# EAGLE design RocketometerPx 9150 (EAGLE 6.2)
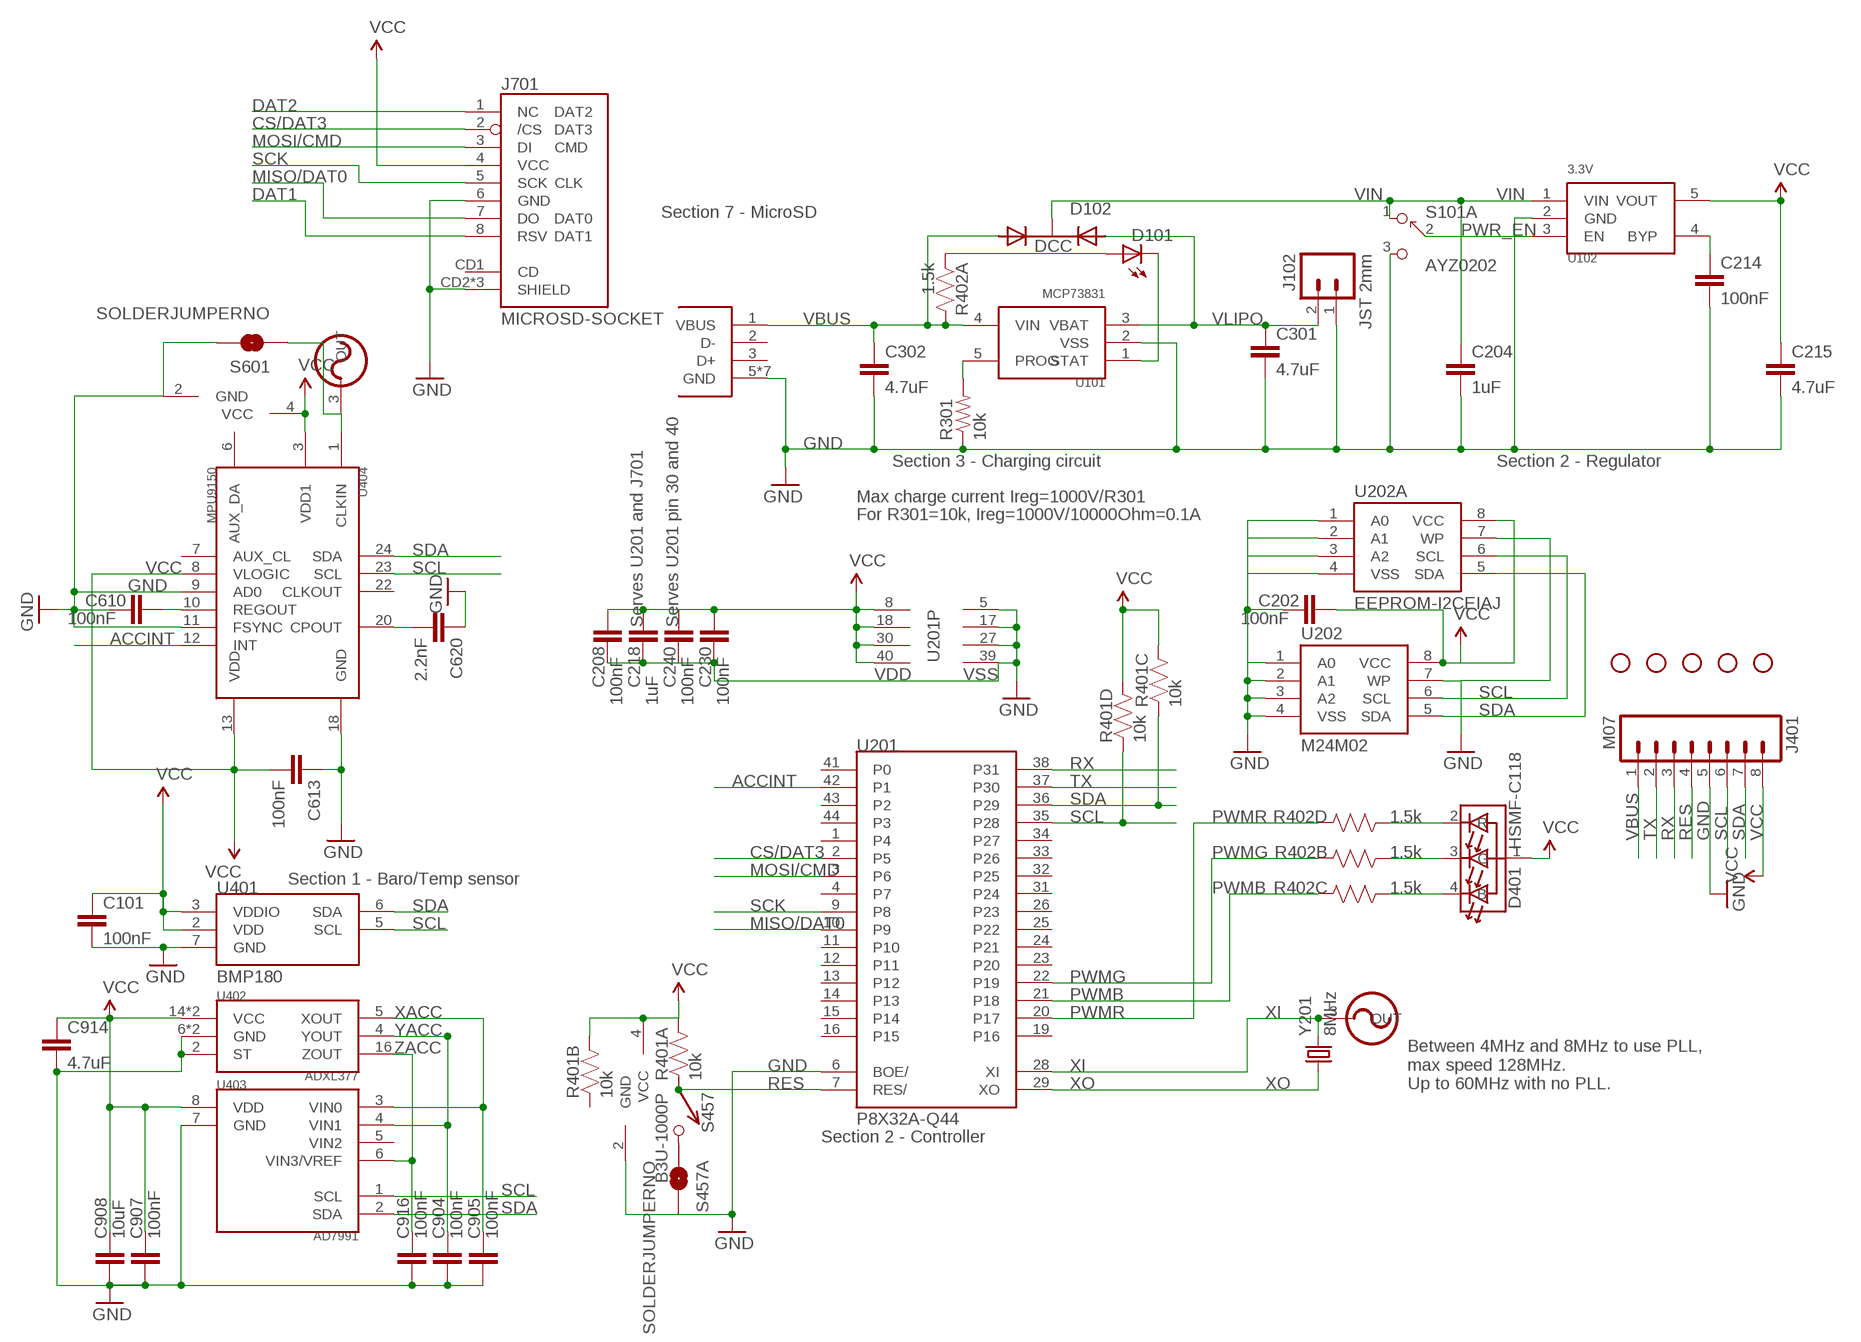
[diagram p0: schematic, sheet 1]

## Parts
C101  100nF  CAP0402-CAP  [0402-CAP]
C202  100nF  CAP0402-CAP  [0402-CAP]
C204  1uF  CAP0402-CAP  [0402-CAP]
C208  100nF  CAP0402-CAP  [0402-CAP]
C214  100nF  CAP0402-CAP  [0402-CAP]
C215  4.7uF  CAP0402-CAP  [0402-CAP]
C218  1uF  CAP0402-CAP  [0402-CAP]
C230  100nF  CAP0402-CAP  [0402-CAP]
C240  100nF  CAP0402-CAP  [0402-CAP]
C301  4.7uF  CAP0402-CAP  [0402-CAP]
C302  4.7uF  CAP0402-CAP  [0402-CAP]
C610  100nF  CAP0402-CAP  [0402-CAP]
C613  100nF  CAP0402-CAP  [0402-CAP]
C620  2.2nF  CAP0402-CAP  [0402-CAP]
C904  100nF  CAP0402-CAP  [0402-CAP]
C905  100nF  CAP0402-CAP  [0402-CAP]
C907  100nF  CAP0402-CAP  [0402-CAP]
C908  10uF  CAP0603-CAP  [0603-CAP]
C914  4.7uF  CAP0402-CAP  [0402-CAP]
C916  100nF  CAP0402-CAP  [0402-CAP]
D101  YELLOW  LED0603  [LED-0603]
D102  DCC  PMEG2005CT  [SOT-23-3]
D401  HSMF-C118  [HSMF-C118]
J101  USB_MICROB_JSTGCT  [USB_MICROB_3075]
J102  JST 2mm  M02-JST-2MM-SMT  [JST-2-SMD]
J401  M07  M081X08  [1X08]
J701  MICROSD-SOCKET  [MICROSD-SOCKET-PP]
JP1  STAND-OFFTIGHT  [STAND-OFF-TIGHT]
JP2  STAND-OFFTIGHT  [STAND-OFF-TIGHT]
JP3  STAND-OFFTIGHT  [STAND-OFF-TIGHT]
JP4  STAND-OFFTIGHT  [STAND-OFF-TIGHT]
JP5  STAND-OFFTIGHT  [STAND-OFF-TIGHT]
R301  10k  RESISTOR0402-RES  [0402-RES]
R401  10k  RP404  [CRA04]
R402  1.5k  RP404  [CRA04]
S101  AYZ0202  [AYZ0202]
S457  B3U-1000P  [B3U-1000P]
S457A  SOLDERJUMPERNO  [SJ_2S-NO]
S601  SOLDERJUMPERNO  [SJ_2S-NO]
U101  MCP73831  [SOT-23-5]
U102  3.3V  MIC5319D5  [SOT-23-5]
U201  P8X32A-Q44  [P8X32A-Q44]
U202  M24M02  EEPROM-I2C  [SO8N]
U202A  EEPROM-I2CEIAJ  [SO08-EIAJ]
U401  BMP180  [BMP180]
U402  ADXL377  [ADXL377]
U403  AD7991  AD799X  [SOT-23-8]
U404  MPU9150  MPU6050  [MPU60X0]
Y201  8MHz  NX3225GD  [CRYSTAL_SMD_3_2MM_2_5MM]
Y202  8MHz  EM53T  [CRYSTAL_SMD_5MM_3_2MM]
Y401  19.2MHz  EM53T  [CRYSTAL_SMD_5MM_3_2MM]

## Nets
ACCINT: U201.42(P1) U404.12(INT)
CS/DAT3: J701.2(/CS) U201.2(P5)
DAT1: J701.8(RSV)
DAT2: J701.1(NC)
GND [power]: C101.2 C202.2 C204.2 C208.2 C214.2 C215.2 C218.2 C230.2 C240.2 C301.2 C302.2 C610.2 C613.1 C620.1 C904.2 C905.2 C907.2 C908.2 C914.2 C916.2 J101.5(GND) J101.P$1(GND) J101.P$2(GND) J101.P$3(GND) J101.P$4(GND) J101.P$8(GND) J101.P$10(GND) J102.1 J401.5 J701.6(GND) J701.CD2(SHIELD) J701.GND1(SHIELD) J701.GND3(SHIELD) R301.1 S101.3 S457A.2 S601.2 U101.2(VSS) U102.2(GND) U201.5(VSS) U201.6(BOE/) U201.17(VSS) U201.27(VSS) U201.39(VSS) U202.1(A0) U202.2(A1) U202.3(A2) U202.4(VSS) U202.7(WP) U202A.1(A0) U202A.2(A1) U202A.3(A2) U202A.4(VSS) U202A.7(WP) U401.7(GND) U402.2(ST) U402.6(GND) U402.7(GND) U403.7(GND) U404.9(AD0) U404.11(FSYNC) U404.18(GND) Y202.2(GND) Y401.2(GND)
MISO/DAT0: J701.7(DO) U201.10(P9)
MOSI/CMD: J701.3(DI) U201.3(P6)
N$1: C620.2 U404.20(CPOUT)
N$2: R301.2 U101.5(PROG)
N$3: S601.1 U404.1(CLKIN) Y401.3(OUT)
N$4: D101.C U101.1(STAT)
N$5: D101.A R402.1
N$8: S457.P$2 S457A.1
N$13: C610.1 U404.10(REGOUT)
N$17: C214.1 U102.4(BYP)
PWMB: R402.6 U201.21(P18)
PWMG: R402.7 U201.22(P19)
PWMR: R402.5 U201.20(P17)
PWR_EN: S101.2 U102.3(EN)
QWMB: D401.4(B) R402.3
QWMG: D401.3(G) R402.2
QWMR: D401.2(R) R402.4
RES: J401.4 R401.1 S457.P$1 U201.7(RES/)
RX: J401.3 U201.38(P31)
SCK: J701.5(SCK) U201.9(P8)
SCL: J401.6 R401.4 U201.35(P28) U202.6(SCL) U202A.6(SCL) U401.5(SCL) U403.1(SCL) U404.23(SCL)
SDA: J401.7 R401.3 U201.36(P29) U202.5(SDA) U202A.5(SDA) U401.6(SDA) U403.2(SDA) U404.24(SDA)
TX: J401.2 U201.37(P30)
VBUS: C302.1 D102.1(A1) J101.1(VBUS) J401.1 R402.8 U101.4(VIN)
VCC [power]: C101.1 C202.1 C208.1 C215.1 C218.1 C230.1 C240.1 C613.2 C907.1 C908.1 C914.1 D401.1(A) J401.8 J701.4(VCC) R401.5 R401.6 R401.7 R401.8 U102.5(VOUT) U201.8(VDD) U201.18(VDD) U201.30(VDD) U201.40(VDD) U202.8(VCC) U202A.8(VCC) U401.2(VDD) U401.3(VDDIO) U402.14(VCC) U402.15(VCC) U403.8(VDD) U404.3(VDD1) U404.8(VLOGIC) U404.13(VDD) Y202.4(VCC) Y401.4(VCC)
VIN: C204.1 D102.3(K) S101.1 U102.1(VIN)
VLIPO: C301.1 D102.2(A2) J102.2 U101.3(VBAT)
XACC: C905.1 U402.5(XOUT) U403.3(VIN0)
XI: U201.28(XI) Y201.2 Y202.3(OUT)
XO: U201.29(XO) Y201.1
YACC: C904.1 U402.4(YOUT) U403.4(VIN1)
ZACC: C916.1 U402.16(ZOUT) U403.6(VIN3/VREF)
Unconnected: J101.2(D-) J101.3(D+) J701.CD1(CD) R401.2 S101.4 S101.5 S101.6 U201.1(P4) U201.4(P7) U201.11(P10) U201.12(P11) U201.13(P12) U201.14(P13) U201.15(P14) U201.16(P15) U201.19(P16) U201.23(P20) U201.24(P21) U201.25(P22) U201.26(P23) U201.31(P24) U201.32(P25) U201.33(P26) U201.34(P27) U201.41(P0) U201.43(P2) U201.44(P3) U403.5(VIN2) U404.6(AUX_DA) U404.7(AUX_CL) U404.22(CLKOUT)

## Notes on the sheet
- Section 7 - MicroSD
- Section 3 - Charging circuit | Section 2 - Regulator
- Max charge current Ireg=1000V/R301
- For R301=10k, Ireg=1000V/10000Ohm=0.1A
- Serves U201 and J701 | Serves U201 pin 30 and 40
- Section 1 - Baro/Temp sensor
- Between 4MHz and 8MHz to use PLL,
  max speed 128MHz. 
  Up to 60MHz with no PLL.
- Section 2 - Controller

## Library data of the parts
C101 C202 C208 C214 C230 C240 C610 C613 C904 C905 C916 = SparkFun:CAP: Capacitor Standard 0603 ceramic capacitor, and 0.1" leaded capacitor.; DIGIKEY: 445-1265-1-ND; NEWARK: 90R7596
C204 C218 = SparkFun:CAP: Capacitor Standard 0603 ceramic capacitor, and 0.1" leaded capacitor.; DIGIKEY: 445-4114-1-ND; NEWARK: 90R7580
C215 C301 C302 C914 = SparkFun:CAP: Capacitor Standard 0603 ceramic capacitor, and 0.1" leaded capacitor.; DIGIKEY: 445-7395-1-ND; NEWARK: 48T2906
C620 = SparkFun:CAP: Capacitor Standard 0603 ceramic capacitor, and 0.1" leaded capacitor.; DIGIKEY: 445-1257-1-ND; NEWARK: 90R7610
C907 = SparkFun-Passives:CAP: Capacitor Standard 0603 ceramic capacitor, and 0.1" leaded capacitor.; DIGIKEY: 445-1265-1-ND; NEWARK: 90R7596
C908 = SparkFun:CAP: Capacitor Standard 0603 ceramic capacitor, and 0.1" leaded capacitor.; DIGIKEY: 445-7486-1-ND; NEWARK: 48T2910
D101 = SparkFun:LED: LEDs Standard schematic elements and footprints for 5mm, 3mm, 1206, and 0603 sized LEDs. 5mm - Spark Fun Electronics SKU : COM-00529 (and others); DIGIKEY: 350-2032-1-ND; NEWARK: 38K3376
D102 = KwanSystems:PMEG2005CT; DIGIKEY: 568-6500-1-ND
D401 = KwanSystems:HSMF-C118; DIGIKEY: 516-1778-1-ND; NEWARK: 52M8002
J101 = KwanSystems:USB_MICROB_JST; DIGIKEY: 455-2562-1-ND
J102 = SparkFun:M02: Header 2 Standard 2-pin 0.1" header. Use with straight break away headers (SKU : PRT-00116), right angle break away headers (PRT-00553), swiss pins (PRT-00743), machine pins (PRT-00117), and female headers (PRT-00115). Molex polarized connector foot print use with SKU : PRT-08233 with associated crimp pins and housings.; DIGIKEY: 455-1749-1-ND
J401 = SparkFun-Connectors:M08: Header 8 Standard 8-pin 0.1" header. Use with straight break away headers (SKU : PRT-00116), right angle break away headers (PRT-00553), swiss pins (PRT-00743), machine pins (PRT-00117), and female headers (PRT-00115).; DIGIKEY: $NOPART
J701 = KwanSystems:MICROSD-SOCKET: microSD Socket Push-push type uSD socket. Digikey 101-00660-68-6-1-ND. tDoc lines correctly indicate media card edge positions when inserting (unlocked, locked, depressed).; DIGIKEY: 101-00581-59-1-ND
JP1 JP2 = SparkFun-Electromechanical:STAND-OFF: #4 Stand Off This is the mechanical footprint for a #4 phillips button head screw. Use the keepout ring to avoid running the screw head into surrounding components. SKU : PRT-00447; DIGIKEY: $NOPART
JP3-JP5 = SparkFun-Electromechanical:STAND-OFF: #4 Stand Off This is the mechanical footprint for a #4 phillips button head screw. Use the keepout ring to avoid running the screw head into surrounding components. SKU : PRT-00447; DIGIKEY: $NOPART; NEWARK: $NOPART
R301 = SparkFun:RESISTOR: Resistor Basic schematic elements and footprints for 0603, 1206, and PTH resistors.; DIGIKEY: P10.0KLCT-ND
R401 = KwanSystems:RP4; DIGIKEY: CRA4S810KCT-ND
R402 = KwanSystems:RP4; DIGIKEY: CRA4S81.5KCT-ND
S101 = KwanSystems:AYZ0202; DIGIKEY: 401-2013-1-ND
S457 = KwanSystems:B3U-1000P; DIGIKEY: SW1020CT-ND
S457A S601 = SparkFun-Passives:SOLDERJUMPER: Solder Jumper Standard SMD solder jumper. Used to automate production. Two varients : Normally Open and Normally Closed are the same, but have different paste layers. NC will have a large amount of paste and should jumper during reflow.; DIGIKEY: $NOPART; NEWARK: $NOPART
U101 = KwanSystems:MCP73831; DIGIKEY: 576-1910-1-ND
U102 = KwanSystems:MIC5319; DIGIKEY: 576-1910-1-ND
U201 = KwanSystems:P8X32A-Q44: Propellor uC; DIGIKEY: P8X32A-Q44-ND
U202 = KwanSystems:EEPROM-I2C; DIGIKEY: 497-11600-1-ND
U202A = KwanSystems:EEPROM-I2C; DIGIKEY: $NOPART
U401 = KwanSystems:BMP180; DIGIKEY: 828-1027-1-ND
U402 = KwanSystems:ADXL377; DIGIKEY: ADXL377BCPZ-RL7CT-ND
U403 = KwanSystems:AD799X; DIGIKEY: AD7991YRJZ-0500RL7CT-ND
U404 = KwanSystems:MPU6050: MPU6050 or MPU9150 Pin 3 is NC on the '6050, VDD on the '9150. Since pin 3 is not internally connected, a socket for the '9150 is compatible with a '6050.; DIGIKEY: $NOPART
Y201 = KwanSystems:NX3225GD; DIGIKEY: 644-1178-1-ND
Y202 Y401 = KwanSystems:EM53T: EM53T temperature compensated oscillator (TCXO) This part contains a crystal and all the rest of the electronics needed to directly produce a clock signal. Temperature compensation means that the part maintains +-2ppm over a wide temperature range.

## Net classes
0 default: width 0.152 mm, drill 0.33 mm, clearance 0.152 mm
1 power: width 0.152 mm, drill 0.33 mm, clearance 0.152 mm to class 0, clearance 0.152 mm
2 hv: width 0.152 mm, drill 0.33 mm, clearance 0.152 mm to class 0, clearance 0.152 mm to class 1, clearance 0.152 mm

## Board
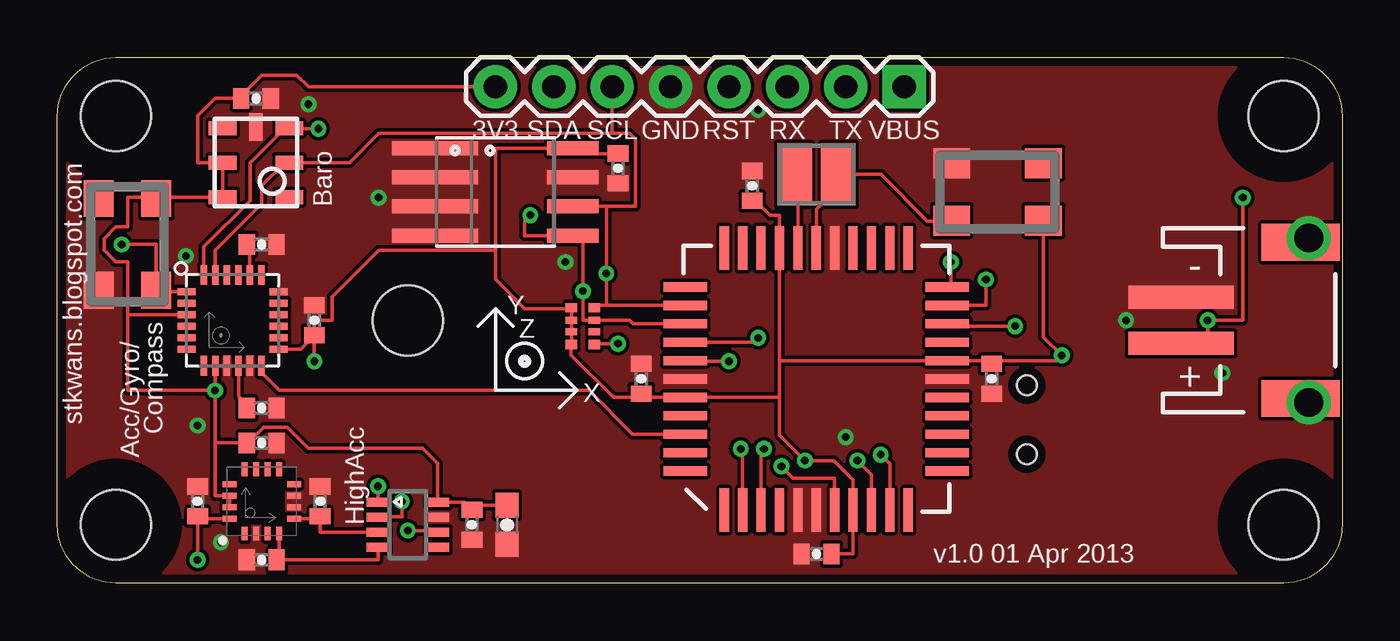
[diagram p1: board, top side]
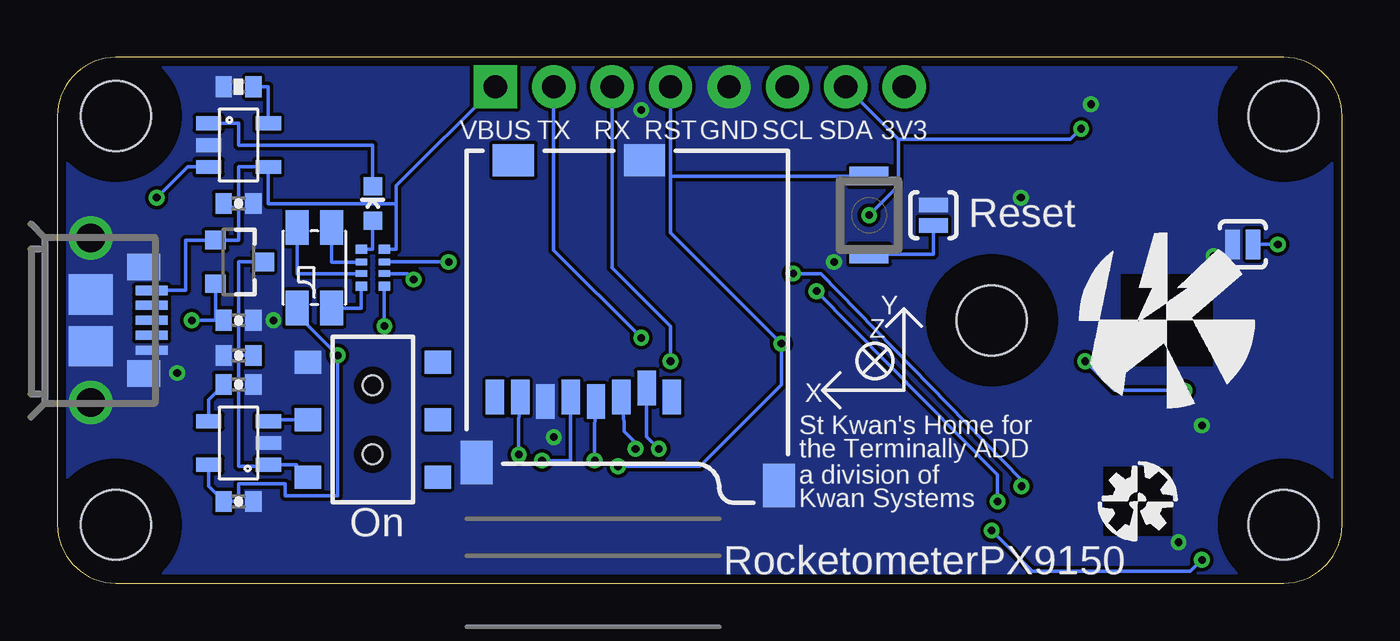
[diagram p2: board, bottom side, seen from below]

Size 55.88 x 22.86 mm. Coordinates in mm from the lower left corner, seen from the top.
Outline: 2.54,22.86 53.34,22.86 arc-90 55.88,20.32 55.88,2.54 arc-90 53.34,0 2.54,0 arc-90 0,2.54 0,20.32 arc-90 2.54,22.86
Copper layers (1*16): Top 0.0356mm / dielectric 1.5011mm / Bottom 0.0356mm
Design rules: minimum track width 6mil, minimum drill 13mil, track to track 6mil, track to pad 6mil, pad to pad 6mil, via to via 6mil, smd to smd 6mil, copper to edge 15mil, drill to drill 6mil, minimum pad ring 7mil, minimum via ring 7mil, stop-mask expansion 4mil, vias tented up to drill 14mil, thermal gap 10mil
tRestrict: area -0.3,17.5 to 5.3,23.1; area 12.4,8.6 to 18,14.2; area -0.3,-0.3 to 5.3,5.3; area 50.5,-0.3 to 56.1,5.3; area 50.5,17.5 to 56.1,23.1
bRestrict: area -0.3,17.5 to 5.3,23.1; area -0.3,-0.3 to 5.3,5.3; area 12.4,8.6 to 18,14.2; area 50.5,17.5 to 56.1,23.1; area 50.5,-0.3 to 56.1,5.3

### Footprints (pad centres in the part's own frame; a part is rotated, then mirrored left to right if it is on the bottom)
0402-CAP = smd 0.7 x 0.9: 1 -0.65,0; 2 0.65,0
0603-CAP = smd 1.1 x 1: 1 -0.85,0; 2 0.85,0
LED-0603 = smd 0.8 x 0.8: A 0,-0.75; C 0,0.75
SOT-23-3 = smd 0.9 x 0.8: 1 -1,0.95; 2 -1,-0.95; 3 1.1,0
HSMF-C118 = smd 1.5 x 1: 1 1.75,-0.75; 2 1.75,0.75; 3 -1.75,0.75; 4 -1.75,-0.75
USB_MICROB_3075 = smd 0.4 x 1.4: 1 -1.3,4.1; 2 -0.65,4.1; 3 0,4.1; 4 0.65,4.1; 5 1.3,4.1 | smd 1.15 x 1.45: P$1 2.32,3.75; P$10 -2.32,3.75 | smd 1.75 x 1.9: P$2 1.125,1.45; P$8 -1.125,1.45 | drill 1.25 pad 1.9: P$3 -3.575,1.45; P$4 3.575,1.45
JST-2-SMD = smd 1 x 4.6: 1 -1,-3.7; 2 1,-3.7 | smd 1.6 x 3.4: NC1 -3.4,1.5; NC2 3.4,1.5
1X08 = drill 1.016 pad 1.88 square: 1 0,0 | drill 1.016 pad 1.88: 2 2.54,0; 3 5.08,0; 4 7.62,0; 5 10.16,0; 6 12.7,0; 7 15.24,0; 8 17.78,0
MICROSD-SOCKET-PP = smd 0.8 x 1.5: 1 -8.94,10.7; 2 -7.84,10.3; 3 -6.74,10.7; 4 -5.64,10.9; 5 -4.54,10.7; 6 -3.44,10.9; 7 -2.34,10.7; 8 -1.24,10.7 | smd 1.8 x 1.4: CD1 -2.05,0.4; CD2 -7.75,0.4 | smd 1.4 x 1.9: GND1 -13.6,14.55; GND3 -0.45,13.55
STAND-OFF-TIGHT = hole 3.048: 0,0
0402-RES = smd 0.7 x 0.9: 1 -0.65,0; 2 0.65,0
CRA04 = smd 0.4 x 0.5: 1 -0.8,-0.5; 4 0.8,-0.5; 5 0.8,0.5; 8 -0.8,0.5 | smd 0.3 x 0.5: 2 -0.25,-0.5; 3 0.25,-0.5; 6 0.25,0.5; 7 -0.25,0.5
AYZ0202 = smd 1 x 1.15: 1 -2.5,2.825; 2 0,2.825; 3 2.5,2.825; 4 -2.5,-2.825; 5 0,-2.825; 6 2.5,-2.825 | hole 0.85: 1.5,0; -1.5,0
B3U-1000P = smd 0.8 x 1.7: P$1 -1.7,0; P$2 1.7,0
SJ_2S-NO = smd 0.635 x 1.27: 1 -0.45,0; 2 0.45,0
SOT-23-5 = smd 0.6 x 1.1: 1 -0.95,-1.3; 2 0,-1.3; 3 0.95,-1.3; 4 0.95,1.3; 5 -0.95,1.3
P8X32A-Q44 = smd 1.9 x 0.4: 1 -5.713,4.013; 2 -5.713,3.212; 3 -5.713,2.413; 4 -5.713,1.613; 5 -5.713,0.812; 6 -5.713,0.013; 7 -5.713,-0.787; 8 -5.713,-1.587; 9 -5.713,-2.388; 10 -5.713,-3.188; 11 -5.713,-3.987; 23 5.688,-3.987; 24 5.688,-3.188; 25 5.688,-2.388; 26 5.688,-1.587; 27 5.688,-0.787; 28 5.688,0.013; 29 5.688,0.812; 30 5.688,1.613; 31 5.688,2.413; 32 5.688,3.212; 33 5.688,4.013 | smd 0.4 x 1.9: 12 -4.013,-5.688; 13 -3.212,-5.688; 14 -2.413,-5.688; 15 -1.613,-5.688; 16 -0.812,-5.688; 17 -0.013,-5.688; 18 0.787,-5.688; 19 1.587,-5.688; 20 2.388,-5.688; 21 3.188,-5.688; 22 3.987,-5.688; 34 3.987,5.713; 35 3.188,5.713; 36 2.388,5.713; 37 1.587,5.713; 38 0.787,5.713; 39 -0.013,5.713; 40 -0.812,5.713; 41 -1.613,5.713; 42 -2.413,5.713; 43 -3.212,5.713; 44 -4.013,5.713
SO8N = smd 0.61 x 2.21: 1 -1.905,-2.616; 2 -0.635,-2.616; 3 0.635,-2.616; 4 1.905,-2.616; 5 1.905,2.616; 6 0.635,2.616; 7 -0.635,2.616; 8 -1.905,2.616
SO08-EIAJ = smd 0.61 x 2.21: 1 -1.905,-3.378; 2 -0.635,-3.378; 3 0.635,-3.378; 4 1.905,-3.378; 5 1.905,3.353; 6 0.635,3.353; 7 -0.635,3.353; 8 -1.905,3.353
BMP180 = smd 0.6 x 1.2: 1 1.5,1.45; 2 0,1.45; 3 -1.5,1.45; 4 -1.5,-1.45; 5 0,-1.45; 6 1.5,-1.45 | smd 1.2 x 0.6: 7 1.55,0
ADXL377 = smd 0.6 x 0.25: 1 -1.4,0.75; 2 -1.4,0.25; 3 -1.4,-0.25; 4 -1.4,-0.75; 9 1.4,-0.75; 10 1.4,-0.25; 11 1.4,0.25; 12 1.4,0.75 | smd 0.25 x 0.6: 5 -0.75,-1.4; 6 -0.25,-1.4; 7 0.25,-1.4; 8 0.75,-1.4; 13 0.75,1.4; 14 0.25,1.4; 15 -0.25,1.4; 16 -0.75,1.4
SOT-23-8 = smd 0.4 x 1: 1 -0.975,-1.3; 2 -0.325,-1.3; 3 0.325,-1.3; 4 0.975,-1.3; 5 0.975,1.3; 6 0.325,1.3; 7 -0.325,1.3; 8 -0.975,1.3
MPU60X0 = smd 0.8 x 0.3: 1 -2,1.25; 2 -2,0.75; 3 -2,0.25; 4 -2,-0.25; 5 -2,-0.75; 6 -2,-1.25; 13 2,-1.25; 14 2,-0.75; 15 2,-0.25; 16 2,0.25; 17 2,0.75; 18 2,1.25 | smd 0.3 x 0.85: 7 -1.25,-1.975; 8 -0.75,-1.975; 9 -0.25,-1.975; 10 0.25,-1.975; 11 0.75,-1.975; 12 1.25,-1.975; 19 1.25,1.975; 20 0.75,1.975; 21 0.25,1.975; 22 -0.25,1.975; 23 -0.75,1.975; 24 -1.25,1.975
CRYSTAL_SMD_3_2MM_2_5MM = smd 1.5 x 2.7: 1 -0.95,0; 2 0.95,0
CRYSTAL_SMD_5MM_3_2MM = smd 1.6 x 1.3: 1 -2,-1.25; 2 2,-1.25; 3 2,1.25; 4 -2,1.25

### Placement (x,y rotation side)
C101  8.64,21.08 0 top
C202  24.38,18.03 270 top
C204  48.01,9.91 180 bottom
C208  33.02,1.27 180 top
C214  48.01,8.64 0 bottom
C215  48.01,3.56 0 bottom
C218  40.64,8.89 270 top
C230  30.23,17.27 90 top
C240  25.4,8.89 90 top
C301  48.01,11.43 0 bottom
C302  48.01,16.51 0 bottom
C610  8.89,7.62 0 top
C613  11.18,11.43 270 top
C620  8.89,14.73 180 top
C904  8.89,1.02 180 top
C905  11.43,3.56 90 top
C907  18.03,2.54 270 top
C908  19.56,2.54 270 top
C914  8.89,6.1 0 top
C916  6.1,3.56 90 top
D101  42.16,16.51 0 bottom
D102  48.01,13.97 0 bottom
D401  44.7,13.72 270 bottom
J101  55.88,11.43 270 bottom
J102  52.58,11.43 270 top
J401  36.83,21.59 180 top
J701  38.09,18.8 180 bottom
JP1  2.54,2.54 0 top
JP2  2.54,20.32 0 top
JP3  15.24,11.43 0 top
JP4  53.34,2.54 0 top
JP5  53.34,20.32 0 top
R301  48.01,21.59 0 bottom
R401  22.86,11.18 90 top
R402  42.16,13.72 270 bottom
S101  42.16,7.11 90 bottom
S457  20.57,16 270 bottom
S457A  17.78,16 90 bottom
S601  4.32,14.73 180 bottom
U101  48.01,19.05 270 bottom
U102  48.01,6.1 90 bottom
U201  33.02,8.89 90 top
U202  19.81,17.02 270 top
U202A  19.05,17.02 270 top
U401  8.64,18.29 90 top
U402  8.89,3.56 90 top
U403  15.24,2.54 270 top
U404  7.62,11.43 0 top
U$4  [AXES]  19.05,8.38 0 top
U$5  [KWAN_ACC]  7.62,11.43 0 bottom
U$6  [OSHW_ACC]  8.89,3.56 0 bottom
Y201  33.02,17.78 0 top
Y202  40.89,17.02 180 top
Y401  3.05,14.73 270 top

### Tracks (layer width: path | path; a pad name or v marks a point on that pad's centre or on a via)
ACCINT
  Top 0.152: U404.12 8.87,9.16 9.65,8.38 23.11,8.38 25.02,6.48 U201.42
CS/DAT3  (via drill 0.33)
  Top 0.152: U201.2 29.81,5.75 v29.72,5.84
  Bottom 0.152: v29.72,5.84 30.25,6.38 J701.2
GND  (via drill 0.33)
  other vias: 46.48,11.43 50.67,9.14 30.48,20.57 7.11,1.78 6.1,6.86 13.97,16.76 5.59,14.22 10.92,20.83 34.29,6.35 22.1,13.97
  pour Top (no thermals): 2.54,22.86 53.34,22.86 arc-90 55.88,20.32 55.88,2.54 arc-90 53.34,0 2.54,0 arc-90 0,2.54 0,20.32 arc-90
  pour Bottom (no thermals): 2.54,22.86 53.34,22.86 arc-90 55.88,20.32 55.88,2.54 arc-90 53.34,0 2.54,0 arc-90 0,2.54 0,20.32 arc-90
MISO/DAT0  (via drill 0.33)
  Top 0.152: U201.10 36.21,5.19 v35.81,5.59
  Bottom 0.152: v35.81,5.59 35.81,7.02 J701.7
MOSI/CMD  (via drill 0.33)
  Top 0.152: U201.3 30.61,5.71 v30.73,5.84
  Bottom 0.152: v30.73,5.84 30.73,6.1 31.24,6.6 31.24,6.97 J701.3
N$1
  Top 0.152: U404.20 8.37,14.73 C620.2
N$2
  Bottom 0.152: R301.2 46.71,21.59 U101.5
N$3  (via drill 0.33)
  Top 0.152: U404.1 4.3,12.68 Y401.3 4.3,14.73 v2.79,14.73
  Bottom 0.152: S601.1 v2.79,14.73
N$4
  Bottom 0.152: D101.C 42.16,19.05 48.01,19.05 48.01,20 U101.1
N$5
  Bottom 0.152: D101.A 42.16,14.52 R402.1
N$8
  Bottom 0.152: S457A.1 17.78,14.3 S457.P$2
N$13
  Top 0.152: C610.1 8.24,7.76 7.87,8.13 U404.10
N$17
  Bottom 0.152: C214.1 49.31,7.99 U102.4
PWMB  (via drill 0.33)
  Top 0.152: U201.21 40.39,12.08 v40.39,13.21
  Bottom 0.152: v40.39,13.21 40.64,13.47 R402.6
PWMG  (via drill 0.33)
  Top 0.152: U201.22 38.86,12.88 v38.86,13.97
  Bottom 0.152: v38.86,13.97 R402.7
PWMR  (via drill 0.33)
  Top 0.152: U201.20 arc90 38.81,11.18 v41.66,11.18
  Bottom 0.152: v41.66,11.18 arc90 v41.66,11.18 R402.5
PWR_EN
  Bottom 0.152: U102.3 46.64,7.11 S101.2
QWMB
  Bottom 0.152: R402.3 45.45,13.47 D401.4
QWMG
  Bottom 0.152: R402.2 43.95,13.97 D401.3
QWMR
  Bottom 0.152: R402.4 42.66,11.97 D401.2
RES  (via drill 0.33)
  Top 0.152: U201.7 33.81,4.57 32,4.57 v31.5,5.08 | v24.38,10.41 23.36,10.41 R401.1
  Bottom 0.152: v31.5,5.08 27.94,5.08 24.38,8.64 v24.38,10.41 29.21,15.24 29.21,17.7 | J401.4 29.21,17.7 | 29.21,17.7 S457.P$1
RX  (via drill 0.33)
  Top 0.152: U201.38 27.33,9.65 v29.21,9.65
  Bottom 0.152: v29.21,9.65 29.21,11.18 31.75,13.72 J401.3
SCK  (via drill 0.33)
  Top 0.152: U201.9 35.41,4.72 v34.8,5.33
  Bottom 0.152: v34.8,5.33 33.55,5.33 J701.5
SCL  (via drill 0.33)
  Top 0.152: U201.35 23.88,12.08 | 23.88,12.08 23.46,12.08 | 23.46,12.08 R401.4 | 23.46,12.08 23.37,12.08 R401.4 | R401.4 23.37,11.94 | U202.6 23.88,16.38 | 23.88,16.38 v23.88,13.46 23.88,12.08 | U404.23 6.86,13.42 6.86,14.48 8.89,16.51 8.89,17.27 9.91,18.29 U401.5 12.7,18.29 13.97,19.56 24.13,19.56 | v13.95,4.22 13.95,3.53 U403.1 | 24.13,19.56 24.89,19.56 25.15,19.3 25.15,16.38 23.88,16.38 | J401.6 24.13,19.56
  Top 0.406: U202A.6 U202.6
  Bottom 0.152: v13.95,4.22 13.95,4.5 22.66,13.46 v23.88,13.46
SDA  (via drill 0.33)
  Top 0.152: U201.36 25.04,11.28 24.89,11.43 R401.3 | R401.3 | R401.3 22.86,11.43 v22.86,12.7 22.86,14.99 22.4,14.99 U202.5 | U202A.5 20.32,15.11 20.32,15.75 v20.57,16 | U404.24 6.37,14.62 8.38,16.64 8.38,18.29 9.88,19.79 U401.6 10.16,19.76 v11.35,19.76 | U403.2 14.33,2.87 14.33,2.9 14.99,2.9 v14.99,3.56
  Top 0.406: U202.5 U202A.5
  Bottom 0.152: 19.3,19.3 19.3,17.27 v20.57,16 | 19.3,19.3 J401.7 | v14.99,3.56 14.99,4.72 v22.86,12.7 | v11.35,19.76 11.81,19.3 19.3,19.3
TX  (via drill 0.33)
  Top 0.152: U201.37 30.29,10.48 v30.48,10.67
  Bottom 0.152: v30.48,10.67 34.29,14.48 J401.2
VBUS
  Bottom 0.152: 41.15,16.51 46.71,16.51 U101.4 48.01,18.1 48.01,16.26 | 41.15,16.51 41.15,14.52 R402.8 | C302.1 48.01,16.26 | 48.01,16.26 48.01,14.92 D102.1 50.29,14.92 50.29,12.73 J101.1 | 41.15,16.51 41.15,17.27 J401.1
VCC  (via drill 0.33)
  Top 0.152: C208.1 34.61,1.27 U201.8 34.61,4.51 33.78,5.33 v32.51,5.33 31.41,6.44 31.41,8.13 | 31.41,9.68 U201.30 31.41,16 30.99,16 30.37,16.62 C230.1 | 31.41,8.13 31.36,8.08 U201.40 25.4,8.08 | R401.8 22.36,10.41 22.35,10.41 | R401.8 R401.7 R401.6 R401.5 22.36,11.95 22.35,11.94 20.32,11.94 19.05,13.21 19.05,14.48 | U202A.8 19.05,18.92 19.05,14.48 | R401.8 22.35,10.37 22.35,9.91 24.18,8.08 25.4,8.08 | J401.8 10.92,21.59 10.41,22.1 8.89,22.1 7.99,21.19 C101.1 6.86,21.08 6.1,20.32 6.1,18.29 U401.2 U401.3 3.81,16.79 | 3.81,16.79 3.05,16.79 3.05,15.49 2.54,15.49 2.03,14.99 2.03,14.48 2.54,13.97 3.05,13.97 3.05,11.68 | 3.05,11.68 U404.3 | U402.15 U402.14 6.86,3.81 6.86,6.1 | 6.86,6.1 C914.1 8.31,6.12 8.97,6.78 9.98,6.78 10.9,5.87 15.89,5.87 16.54,5.22 U403.8 17.71,3.52 C907.1 18.23,3.39 C908.1 | 6.87,6.11 6.86,6.1 | U404.8 6.86,9.44 v6.86,8.38 | v6.86,8.38 6.86,6.1 | 3.05,11.68 3.05,8.38 v6.86,8.38 | C613.2 11.18,11.43 11.94,11.43 11.94,12.45 13.97,14.48 19.05,14.48 | 31.41,9.68 U201.18 40.64,9.68 | 31.41,9.68 31.41,8.13 | C613.2 v11.18,9.65 | U404.13 10.58,10.18 C613.2 | C240.1 25.4,8.08 | 40.64,9.68 43.46,9.68 v43.69,9.91 42.89,10.7 Y202.4 | C218.1 40.64,9.68 | U202.8 22.67,18.68 C202.1 | Y401.4 3.81,16.73 3.81,16.79
  Top 0.406: U202A.8 U202.8
  Bottom 0.152: U102.5 49.31,4.21 C215.1 48.01,3.56 48.01,4.32 45.97,4.32 45.97,3.81 43.69,3.81 v43.69,9.91 45.45,11.67 D401.1 | v32.51,5.33 32.51,6.82 J701.4 | v11.18,9.65 9.91,8.38 v6.86,8.38
VIN
  Bottom 0.152: S101.1 45.46,5.08 45.47,5.08 45.47,5.15 U102.1 46.77,5.08 48.01,5.08 48.01,9.91 | C204.1 48.01,9.91 | 48.01,9.91 48.01,13.97 D102.3
VLIPO  (via drill 0.33)
  Top 0.152: J102.2 50.04,10.43 v50.04,11.43 51.56,11.43 v51.56,16.76
  Bottom 0.152: v50.04,11.43 C301.1 49.01,11.43 D102.2 | v51.56,16.76 50.23,18.1 U101.3
XACC
  Top 0.152: U403.3 11.43,2.21 C905.1 11.43,2.81 U402.5
XI
  Top 0.152: U201.28 33.02,16.26 33.97,17.21 Y201.2 35.81,17.78 37.85,15.75 38.87,15.75 Y202.3
XO
  Top 0.152: Y201.1 32.21,17.41 U201.29
YACC
  Top 0.152: U402.4 9.64,1.02 C904.1 13.94,1.02 U403.4
ZACC  (via drill 0.33)
  Top 0.152: C916.1 6.2,2.81 U402.16 | v15.24,2.29 16.51,2.29 U403.6 | 5.84,2.79 6.1,3.05 C916.1 | v6.1,1.02 C916.1
  Bottom 0.152: v15.24,2.29 13.46,0.51 6.6,0.51 v6.1,1.02

### Text on the board
tPlace: 3V3 | SDA | SCL | GND | RST | RX | TX | VBUS | stkwans.blogspot.com | Baro | - | + | Compass | Acc/Gyro/ | HighAcc | v1.0 01 Apr 2013
bPlace: 3V3 | SDA | SCL | GND | RST | RX | TX | VBUS | Reset | St Kwan's Home for | the Terminally ADD | a division of | Kwan Systems | On | RocketometerPX9150